# Altium schematic sheet HLK-10M051_HLK-10M05.schdoc
size 124 x 99 mm
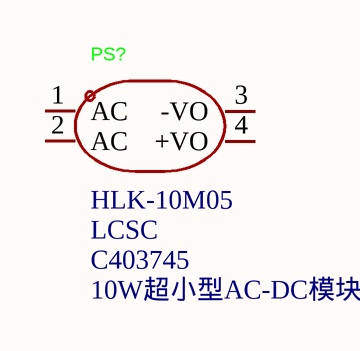
[diagram p0: HLK-10M051_HLK-10M05.schdoc]

## Parts
PS?  LCSC Part Name: 10W超小型AC-DC模块电源  Supplier Part: C403745  Supplier: LCSC  [PWRM-TH_HLK-10M05]  (hidden comment: HLK-10M05)

## Nets

Not connected (* = marked no-connect by the designer): PS? 1(AC) 2(AC) 3(-VO) 4(+VO)

## Library data of the parts
PS? = HLK-10M05: Manufacturer: HI-LINK(海凌科); Add into BOM: yes; Symbol: HLK-10M05; Device: HLK-10M05; Manufacturer Part: HLK-10M05; Supplier Footprint: DIP,46.9x27.8mm; JLCPCB Part Class: Extended Part; Datasheet: https://item.szlcsc.com/datasheet/HLK-10M05/389994.html; Convert to PCB: yes